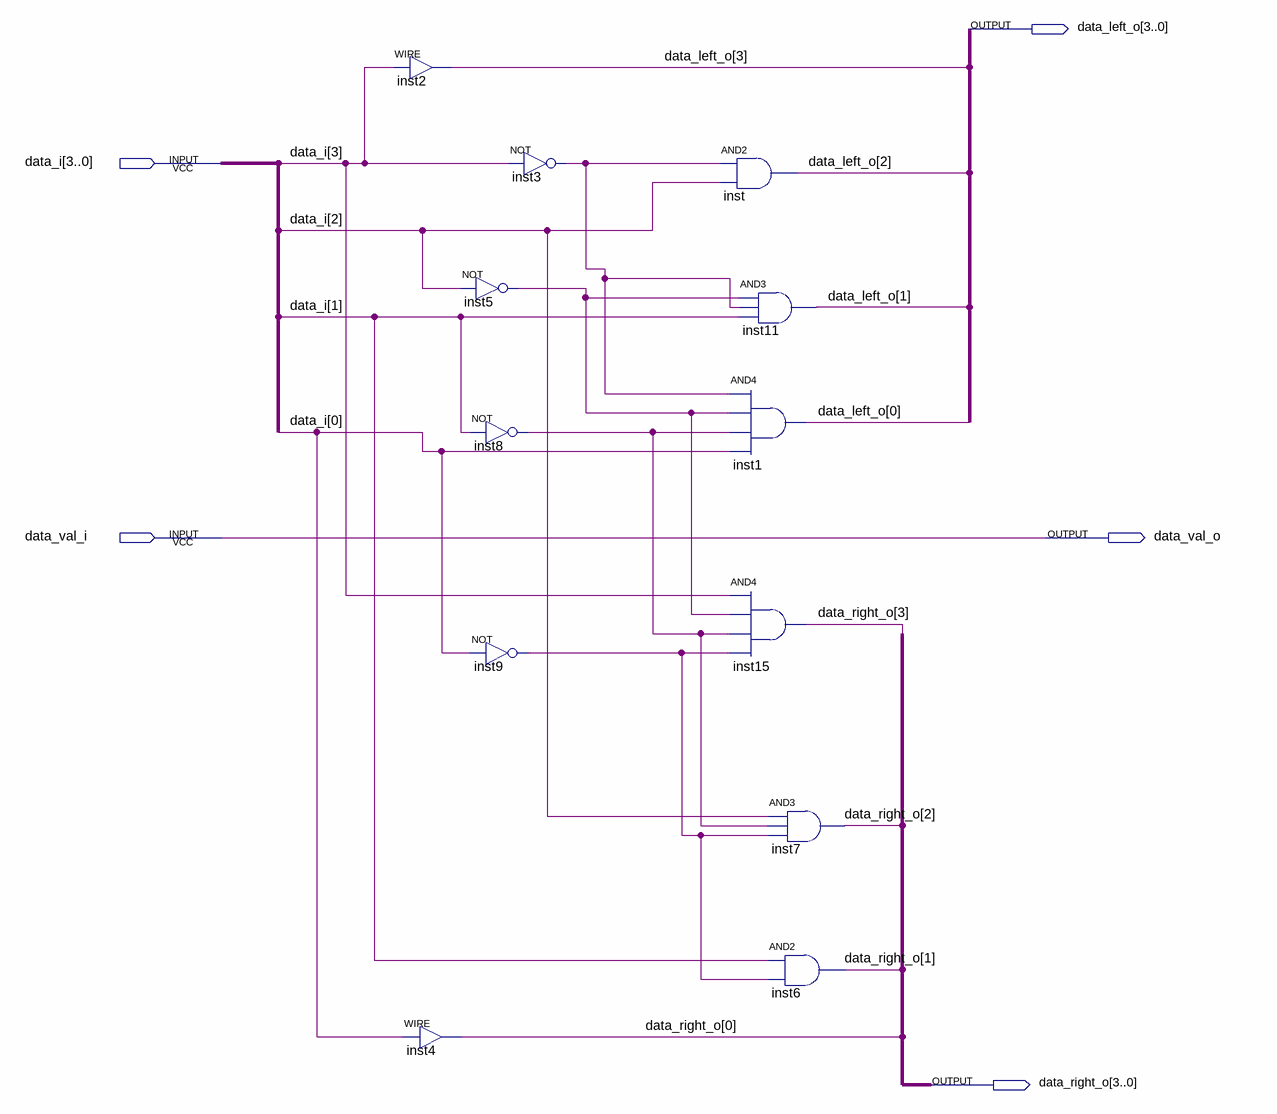
[diagram p0: schematic sheet]
// Quartus schematic priority_encoder_4.bdf as structural Verilog: 12 symbols, 5 pins
module priority_encoder_4 (
  input  [3:0] data_i,
  input  data_val_i,
  output [3:0] data_left_o,
  output data_val_o,
  output [3:0] data_right_o
);

  wire inst3_out, inst5_out, inst8_out, inst9_out;

  assign data_left_o[3] = data_i[3];  // WIRE inst2
  not inst5 (inst5_out, data_i[2]);
  not inst8 (inst8_out, data_i[1]);
  not inst9 (inst9_out, data_i[0]);
  assign data_right_o[0] = data_i[0];  // WIRE inst4
  not inst3 (inst3_out, data_i[3]);
  and inst (data_left_o[2], inst3_out, data_i[2]);
  and inst11 (data_left_o[1], inst5_out, inst3_out, data_i[1]);
  and inst1 (data_left_o[0], inst3_out, inst5_out, inst8_out, data_i[0]);
  and inst15 (data_right_o[3], data_i[3], inst5_out, inst8_out, inst9_out);
  and inst7 (data_right_o[2], data_i[2], inst8_out, inst9_out);
  and inst6 (data_right_o[1], data_i[1], inst9_out);

  assign data_val_o = data_val_i;
endmodule
